# EasyEDA Pro project CANBUSdataLoggerProjectFileV1.2.epro

# Schematic Schematic1
Board Name: Board1; Create Date: 2025-11-18; Page Name: P1; Project Name: carInfoDisplay; Schematic Name: Schematic1; Update Date: 2025-11-19; Company: EasyEDA.com; Page Size: A4; Version: V1.0
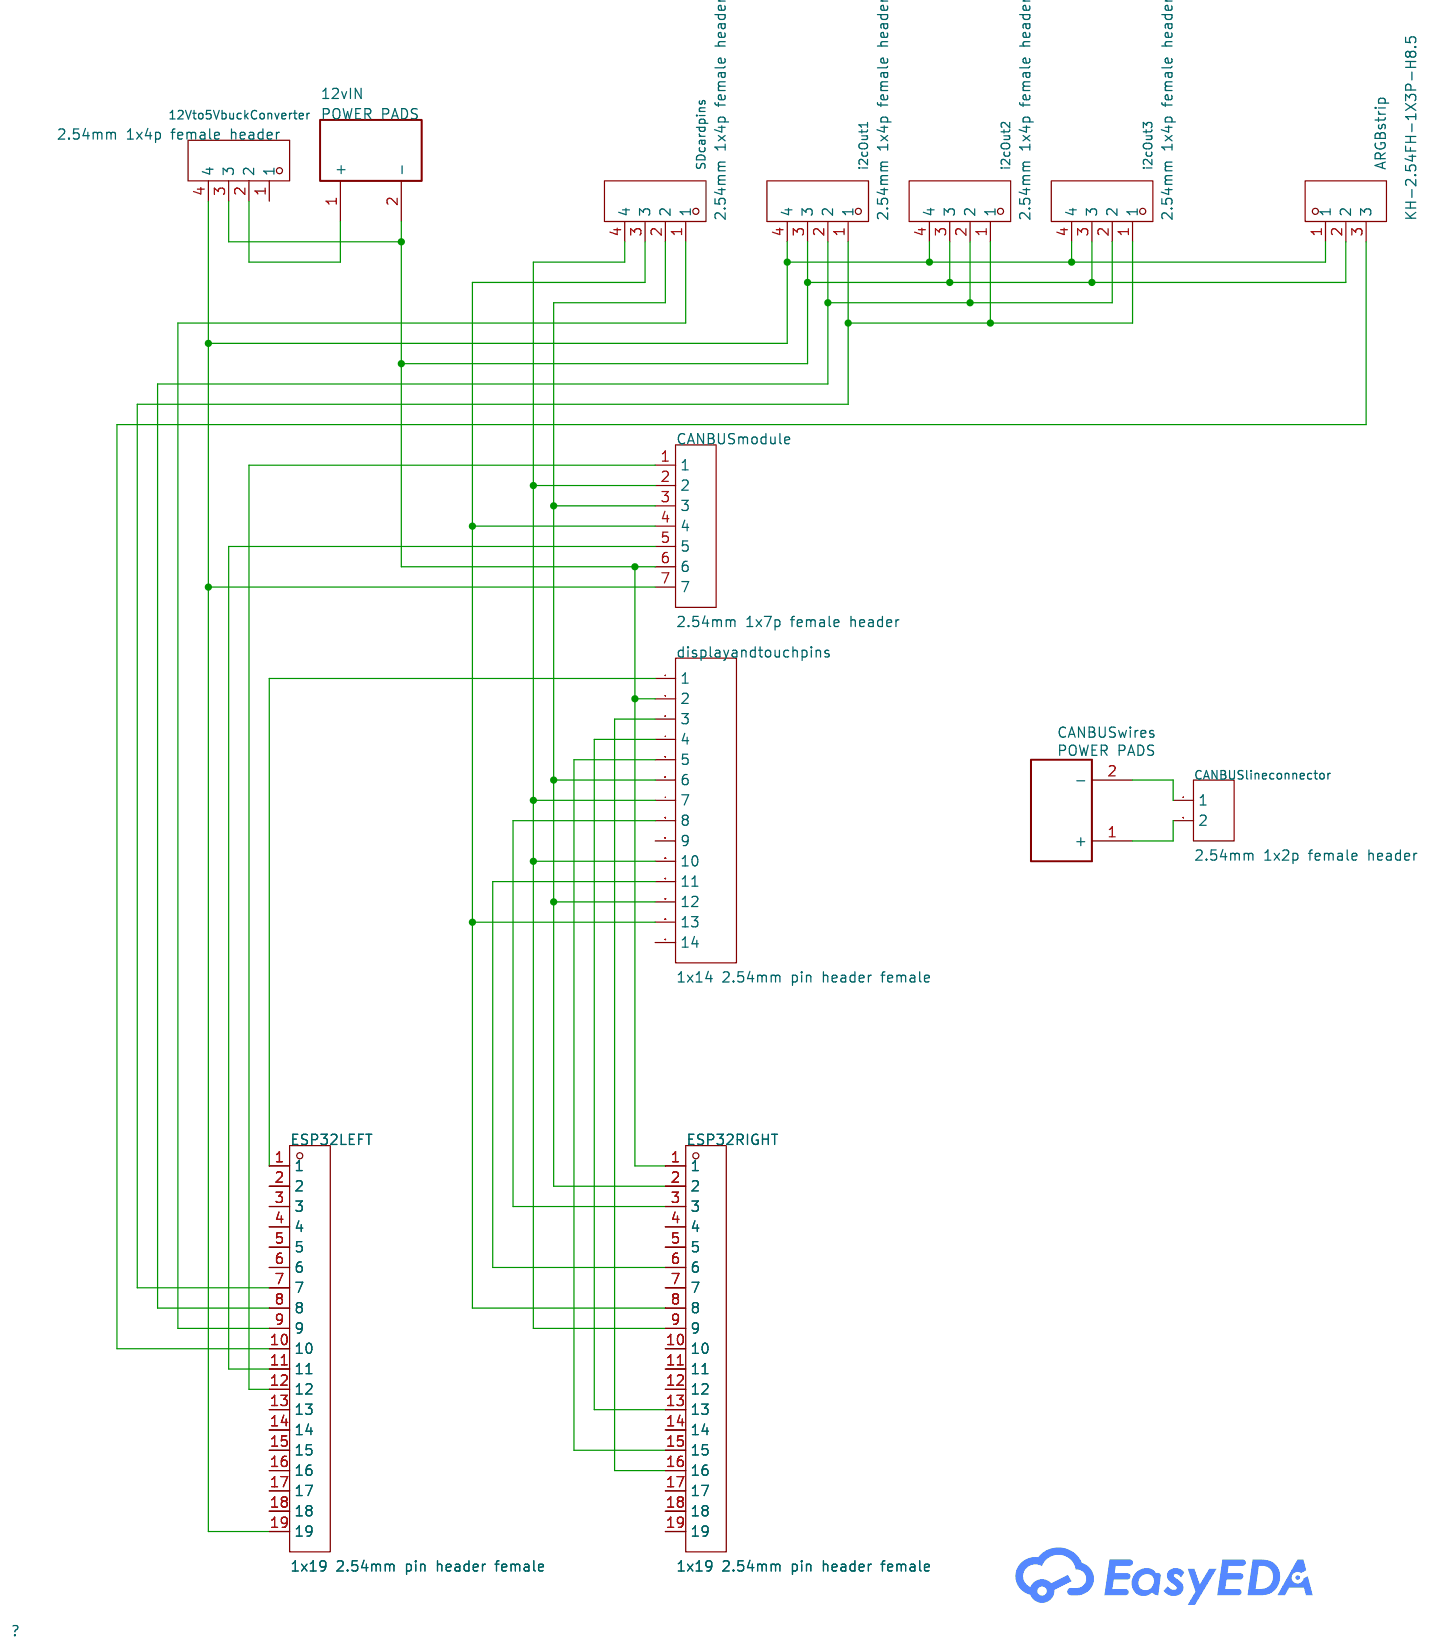
[diagram p0: schematic sheet]

## Parts
12vIN  POWER PADS  [POWERPADS]
12Vto5VbuckConverter  2.54mm 1x4p female header  [HDR-TH_4P-P2.54-V-F]
ARGBstrip  KH-2.54FH-1X3P-H8.5  [HDR-TH_3P-P2.54-V-F]
CANBUSlineconnector  2.54mm 1x2p female header  [HDR-TH_2P-P2.54-V-F]
CANBUSmodule  2.54mm 1x7p female header  [HDR-TH_7P-P2.54-V-F]
CANBUSwires  POWER PADS  [POWERPADS]
displayandtouchpins  1x14 2.54mm pin header female  [HDR-TH_14P-P2.54-V-F-1]
ESP32LEFT  1x19 2.54mm pin header female  [HDR-TH_19P-P2.54-V-F]
ESP32RIGHT  1x19 2.54mm pin header female  [HDR-TH_19P-P2.54-V-F]
i2cOut1  2.54mm 1x4p female header  [HDR-TH_4P-P2.54-V-F]
i2cOut2  2.54mm 1x4p female header  [HDR-TH_4P-P2.54-V-F]
i2cOut3  2.54mm 1x4p female header  [HDR-TH_4P-P2.54-V-F]
SDcardpins  2.54mm 1x4p female header  [HDR-TH_4P-P2.54-V-F]

## Library data of the parts
12vIN CANBUSwires = POWER PADS: Contributor: tomicode; spicePre: P
12Vto5VbuckConverter i2cOut1-i2cOut3 SDcardpins = 2.54-1*4P母: Holes Structure:1x4P Pitch:2.54mm Row Spacing:- Circular Hole / Square Hole:Square Hole Mounting Type:Through Hole Number of Rows:1 Number of Positions:4P Current Rating:3A Voltage Rating (Max):- Holes Direction:Top Insulation Height:- Contact Material:Br; LCSC Part Name: 间距:2.54mm 1x4P 直插; Supplier Part: C2718488; Manufacturer: BOOMELE(博穆精密); Supplier Footprint: 插件,P=2.54mm; JLCPCB Part Class: Extended Part; Datasheet: https://item.szlcsc.com/datasheet/2.54-1*4P%25E6%25AF%258D/2834502.html; Supplier: LCSC; Holes Structure: 1x4P; Pitch: 2.54mm; Circular Hole / Square Hole: Square Hole; Mounting Type: Through Hole; Number of Rows: 1; Number of Positions: 4P; Current Rating: 3A; Holes Direction: Top; Contact Material: Bronze; Operating Temperature: -40℃~+105℃
ARGBstrip = KH-2.54FH-1X3P-H8.5: Holes Structure:1x3P Pitch:2.54mm Row Spacing:- Circular Hole / Square Hole:Square Hole Mounting Type:Through Hole Number of Rows:1 Number of Positions:3P Current Rating:3A Voltage Rating (Max):- Holes Direction:Top Insulation Height:8.5mm Operating Tempe; LCSC Part Name: 间距:2.54mm 1x3P 直插; Supplier Part: C2932670; Manufacturer: kinghelm(金航标); Supplier Footprint: 插件,P=2.54mm; JLCPCB Part Class: Extended Part; Datasheet: https://item.szlcsc.com/datasheet/KH-2.54FH-1X3P-H8.5/3278191.html; Supplier: LCSC; Holes Structure: 1x3P; Pitch: 2.54mm; Circular Hole / Square Hole: Square Hole; Mounting Type: Through Hole; Number of Rows: 1; Number of Positions: 3P; Current Rating: 3A; Holes Direction: Top; Insulation Height: 8.5mm; Operating Temperature: -40℃~+105℃
CANBUSlineconnector = 2.54-1*2P母: Holes Structure:1x2P Pitch:2.54mm Row Spacing:- Circular Hole / Square Hole:Square Hole Mounting Type:Through Hole Number of Rows:1 Number of Positions:2P Current Rating:3A Holes Direction:Top Insulation Height:3.3mm Contact Material:- Contact Plating:- O; LCSC Part Name: 1x2P 间距:2.54mm 直插; Supplier Part: C49661; Manufacturer: BOOMELE(博穆精密); Supplier Footprint: 插件,P=2.54mm; JLCPCB Part Class: Extended Part; Datasheet: https://item.szlcsc.com/datasheet/2.54-1*2P%25E6%25AF%258D/50669.html; Supplier: LCSC; Holes Structure: 1x2P; Pitch: 2.54mm; Circular Hole / Square Hole: Square Hole; Mounting Type: Through Hole; Number of Rows: 1; Number of Positions: 2P; Current Rating: 3A; Holes Direction: Top; Insulation Height: 3.3mm; Operating Temperature: -40℃~+105℃
CANBUSmodule = HC-PM254-8.5H-1x7PZ: Holes Structure:1x7P Pitch:2.54mm Row Spacing:- Circular Hole / Square Hole:Square Hole Mounting Type:Through Hole Number of Rows:1 Number of Positions:7P Current Rating:3A Voltage Rating (Max):- Holes Direction:Top Insulation Height:8.5mm Contact Materia; LCSC Part Name: 间距2.54mm 1x7Pin 直插 PC3.0 H8.5; Supplier Part: C22373893; Manufacturer: HC(虹成电子); Supplier Footprint: 插件,P=2.54mm; JLCPCB Part Class: Extended Part; Datasheet: https://item.szlcsc.com/datasheet/HC-PM254-8.5H-1x7PZ/23870229.html; Supplier: LCSC; Holes Structure: 1x7P; Pitch: 2.54mm; Circular Hole / Square Hole: Square Hole; Mounting Type: Through Hole; Number of Rows: 1; Number of Positions: 7P; Current Rating: 3A; Holes Direction: Top; Insulation Height: 8.5mm; Contact Material: Brass; Contact Plating: Gold; Operating Temperature: -40℃~+105℃; PIN Length: 3mm
displayandtouchpins = 2.54-1*14P母: Holes Structure:1x14P Pitch:2.54mm Row Spacing:- Circular Hole / Square Hole:Square Hole Mounting Type:Through Hole Number of Rows:1 Number of Positions:14P Current Rating:3A Voltage Rating (Max):- Holes Direction:Top Insulation Height:3.3mm Contact Mater; LCSC Part Name: 1x14P 间距:2.54mm 直插; Supplier Part: C52711; Manufacturer: BOOMELE(博穆精密); Supplier Footprint: 插件,P=2.54mm; JLCPCB Part Class: Extended Part; Datasheet: https://item.szlcsc.com/datasheet/2.54-1*14P%25E6%25AF%258D/53725.html; Supplier: LCSC; Holes Structure: 1x14P; Pitch: 2.54mm; Circular Hole / Square Hole: Square Hole; Mounting Type: Through Hole; Number of Rows: 1; Number of Positions: 14P; Current Rating: 3A; Holes Direction: Top; Insulation Height: 3.3mm; Operating Temperature: -40℃~+105℃
ESP32LEFT ESP32RIGHT = KH-2.54FH-1X19P-H8.5: Holes Structure:1x19P Pitch:2.54mm Row Spacing:- Circular Hole / Square Hole:Square Hole Mounting Type:Through Hole Number of Rows:1 Number of Positions:19P Current Rating:3A Voltage Rating (Max):- Holes Direction:Top Insulation Height:8.5mm Operating Tem; LCSC Part Name: 间距:2.54mm 1x19P 直插; Supplier Part: C2932678; Manufacturer: kinghelm(金航标); Supplier Footprint: 插件,P=2.54mm; JLCPCB Part Class: Extended Part; Datasheet: https://item.szlcsc.com/datasheet/KH-2.54FH-1X19P-H8.5/3278199.html; Supplier: LCSC; Holes Structure: 1x19P; Pitch: 2.54mm; Circular Hole / Square Hole: Square Hole; Mounting Type: Through Hole; Number of Rows: 1; Number of Positions: 19P; Current Rating: 3A; Holes Direction: Top; Insulation Height: 8.5mm; Operating Temperature: -40℃~+105℃

## Nets
$1N1624: displayandtouchpins.1 ESP32LEFT.1
$1N1629: 12vIN.2(-) 12Vto5VbuckConverter.3 ARGBstrip.2 CANBUSmodule.6 displayandtouchpins.2 ESP32RIGHT.1 i2cOut1.3 i2cOut2.3 i2cOut3.3
$1N1636: displayandtouchpins.3 ESP32RIGHT.16
$1N1643: displayandtouchpins.4 ESP32RIGHT.13
$1N1650: displayandtouchpins.5 ESP32RIGHT.15
$1N1657: CANBUSmodule.3 displayandtouchpins.6 displayandtouchpins.12 ESP32RIGHT.2 SDcardpins.2
$1N1663: CANBUSmodule.2 displayandtouchpins.7 displayandtouchpins.10 ESP32RIGHT.9 SDcardpins.4
$1N1670: displayandtouchpins.8 ESP32RIGHT.3
$1N1691: displayandtouchpins.11 ESP32RIGHT.6
$1N1709: CANBUSmodule.4 displayandtouchpins.13 ESP32RIGHT.8 SDcardpins.3
$1N1824: CANBUSmodule.1 ESP32LEFT.12
$1N1870: CANBUSmodule.5 ESP32LEFT.11
$1N1888: 12Vto5VbuckConverter.4 ARGBstrip.1 CANBUSmodule.7 ESP32LEFT.19 i2cOut1.4 i2cOut2.4 i2cOut3.4
$1N1979: CANBUSlineconnector.2 CANBUSwires.1(+)
$1N1984: CANBUSlineconnector.1 CANBUSwires.2(-)
$1N2085: 12vIN.1(+) 12Vto5VbuckConverter.2
$1N2121: ESP32LEFT.9 SDcardpins.1
$1N2367: ESP32LEFT.8 i2cOut1.2 i2cOut2.2 i2cOut3.2
$1N2374: ESP32LEFT.7 i2cOut1.1 i2cOut2.1 i2cOut3.1
$1N3081: ARGBstrip.3 ESP32LEFT.10

Not connected (* = marked no-connect by the designer): 12Vto5VbuckConverter 1; displayandtouchpins 9 14; ESP32LEFT 2 3 4 5 6 13 14 15 16 17 18; ESP32RIGHT 4 5 7 10 11 12 14 17 18 19

# Board PCB1
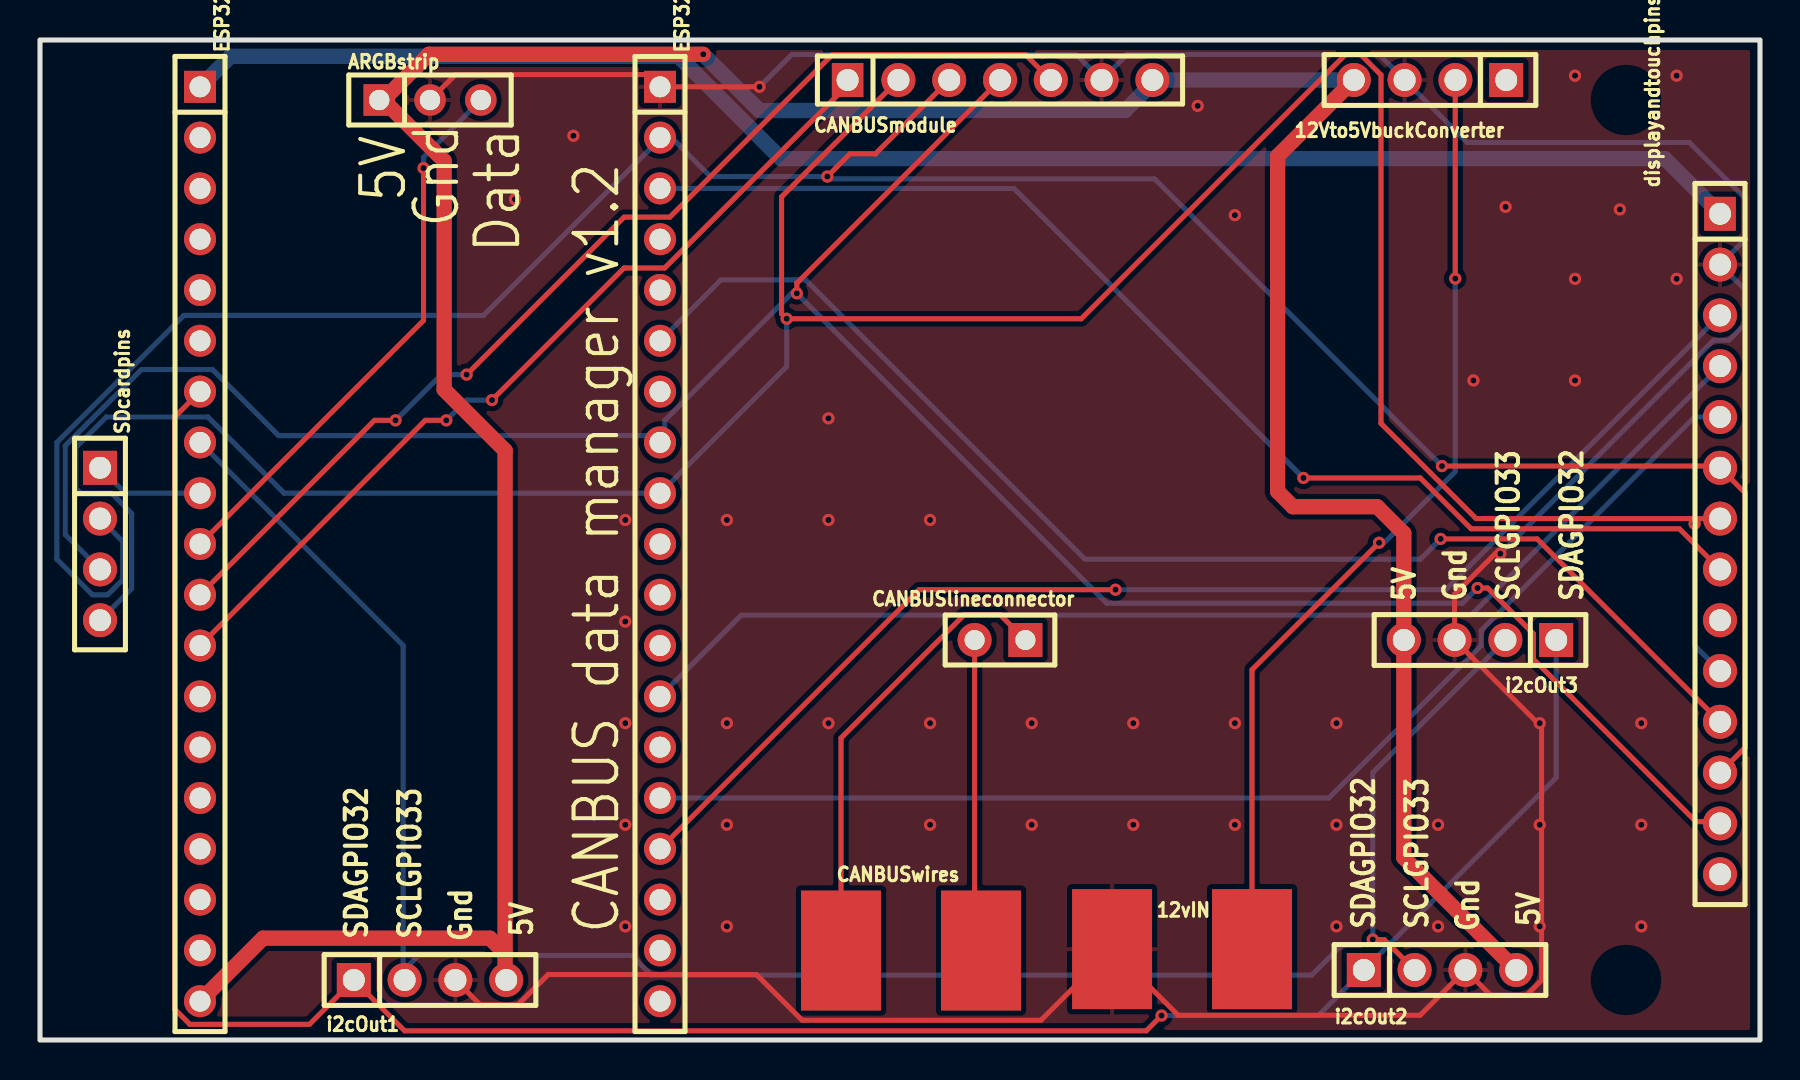
[diagram p1: board, top side]
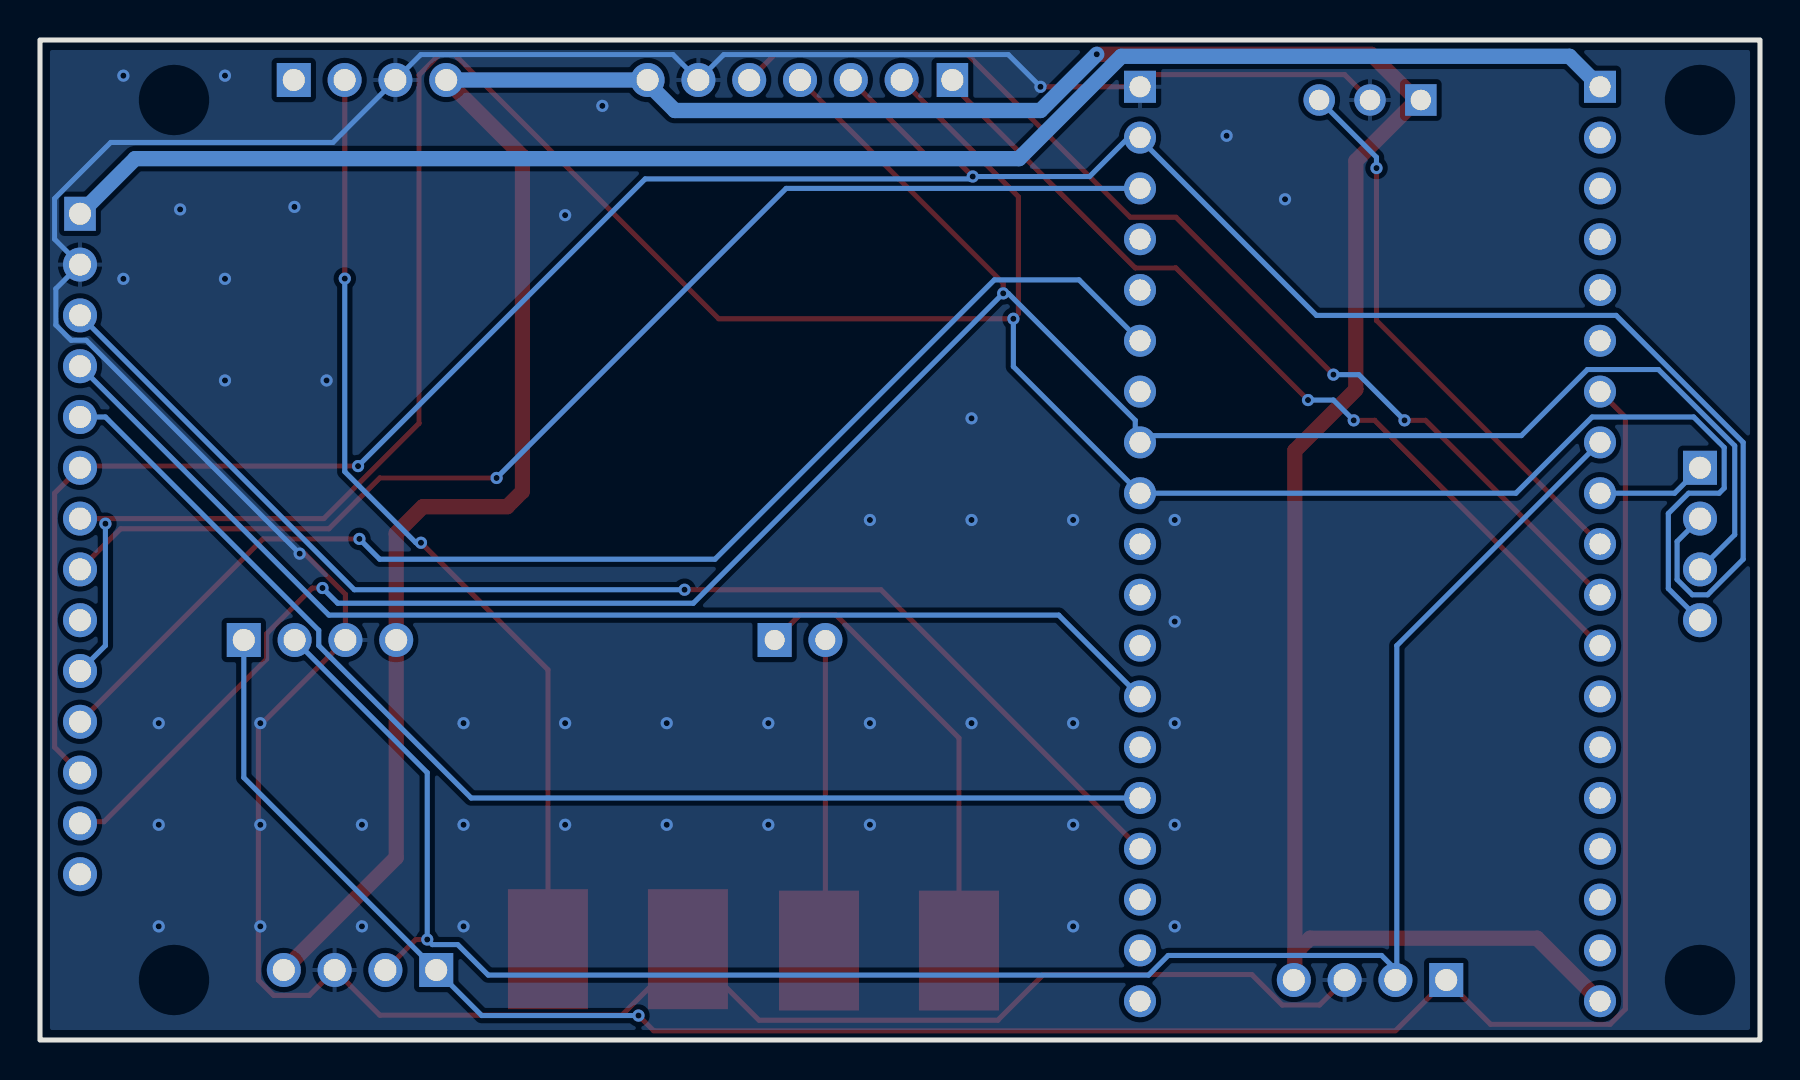
[diagram p2: board, bottom side, seen from below]

Outline 86 x 50 mm; copper layers: Top Layer, Bottom Layer. Coordinates in mm from the lower left corner of the outline.
Outline path: rectangle 0,50 86,0
Stack: Top Layer 0.035mm / Dielectric1 1.51mm FR4 er 4.5 / Bottom Layer 0.035mm

## Design rules (mm)
template: Custom Config
spacing copperThickness1oz (default): track to track 0.102, other pairs 0.152 to 0.3
spacing copperThickness2oz: track to track 0.203, other pairs 0.152 to 0.3
track width copperThickness1oz (default): min 0.127, default 0.254, max 2.54
track width copperThickness2oz: min 0.203, default 0.254, max 2.54
track width powerTracks: min 0.127, default 0.762, max 2.54
differential pair differentialPair (default): width min 0.127, default 0.254, max 2.54; gap min 0.152, default 0.152
via viaSize (default): diameter min 0.5, default 0.61, max 10; hole min 0.3, default 0.305, max 6.3
net $1N1888 uses powerTracks
net $1N1624 uses powerTracks

## Placement (name value [footprint] x y rotation side)
12vIN  POWER PADS  [POWERPADS]  60.54 4.39 90 top
12Vto5VbuckConverter  2.54mm 1x4p female header  [HDR-TH_4P-P2.54-V-F]  69.5 48 180 top
ARGBstrip  KH-2.54FH-1X3P-H8.5  [HDR-TH_3P-P2.54-V-F]  19.5 47 0 top
CANBUSlineconnector  2.54mm 1x2p female header  [HDR-TH_2P-P2.54-V-F]  48 20 180 top
CANBUSmodule  2.54mm 1x7p female header  [HDR-TH_7P-P2.54-V-F]  48 48 0 top
CANBUSwires  POWER PADS  [POWERPADS]  46.99 4.32 90 top
displayandtouchpins  1x14 2.54mm pin header female  [HDR-TH_14P-P2.54-V-F-1]  84 24.8 270 top
ESP32LEFT  1x19 2.54mm pin header female  [HDR-TH_19P-P2.54-V-F]  8 24.8 270 top
ESP32RIGHT  1x19 2.54mm pin header female  [HDR-TH_19P-P2.54-V-F]  31 24.8 270 top
i2cOut1  2.54mm 1x4p female header  [HDR-TH_4P-P2.54-V-F]  19.5 3 0 top
i2cOut2  2.54mm 1x4p female header  [HDR-TH_4P-P2.54-V-F]  70 3.5 0 top
i2cOut3  2.54mm 1x4p female header  [HDR-TH_4P-P2.54-V-F]  72 20 180 top
SDcardpins  2.54mm 1x4p female header  [HDR-TH_4P-P2.54-V-F]  3 24.8 270 top

## Footprints (pads in the part's own frame, mm; a bottom-side part is the same pattern mirrored in y, then rotated)
HDR-TH_2P-P2.54-V-F
  rect 1.7x1.7 hole 1: 1(-1.27,0)
  round 1.7 hole 1: 2(1.27,0)
HDR-TH_3P-P2.54-V-F
  rect 1.575x1.575 hole 1.02: 1(-2.54,0)
  round 1.575 hole 1.02: 2(0,0) 3(2.54,0)
HDR-TH_4P-P2.54-V-F
  rect 1.7x1.7 hole 1.1: 1(-3.81,0)
  round 1.7 hole 1.1: 2(-1.27,0) 3(1.27,0) 4(3.81,0)
HDR-TH_7P-P2.54-V-F
  rect 1.575x1.7 hole 1.1: 1(-7.62,0)
  round 1.7 hole 1.1: 2(-5.08,0) 3(-2.54,0) 4(0,0) 5(2.54,0) 6(5.08,0) 7(7.62,0)
HDR-TH_14P-P2.54-V-F-1
  rect 1.7x1.575 hole 1.1: 1(-16.51,0)
  round 1.7 hole 1.1: 2(-13.97,0) 3(-11.43,0) 4(-8.89,0) 5(-6.35,0) 6(-3.81,0) 7(-1.27,0) 8(1.27,0) 9(3.81,0) 10(6.35,0) 11(8.89,0) 12(11.43,0) 13(13.97,0) 14(16.51,0)
HDR-TH_19P-P2.54-V-F
  rect 1.6x1.6 hole 1.05: 1(-22.86,0)
  round 1.6 hole 1.05: 2(-20.32,0) 3(-17.78,0) 4(-15.24,0) 5(-12.7,0) 6(-10.16,0) 7(-7.62,0) 8(-5.08,0) 9(-2.54,0) 10(0,0) 11(2.54,0) 12(5.08,0) 13(7.62,0) 14(10.16,0) 15(12.7,0) 16(15.24,0) 17(17.78,0) 18(20.32,0) 19(22.86,0)
POWERPADS
  rect 6x4 smd: 1(0.152,-0.06) 2(0.152,6.939)

## Nets
As in the schematic.

Pads without a net: 12Vto5VbuckConverter 1; displayandtouchpins 9 14; ESP32LEFT 2 3 4 5 6 13 14 15 16 17 18; ESP32RIGHT 4 5 7 10 11 12 14 17 18 19

## Via types
v1: diameter 0.61, hole 0.305, Top Layer to Bottom Layer, 65 vias

## Routing (per net, layer and track width the routed paths; a pad name or vN(x,y) marks a point on that pad's centre or on a via; arc(x,y) is an arc through that point)
$1N1624: length 79.9
  Bottom Layer w0.762: displayandtouchpins.1 81.24,44.07 37.04,44.07 31.93,49.18 9.52,49.18 ESP32LEFT.1
$1N1629: length 180.8
  Top Layer w0.254: v1(73.02,24.32) 72.76,24.32 70.73,22.29 i2cOut3.3 75.08,15.65 75.08,2.99 74.32,2.23 72.54,2.23 i2cOut2.3 69.01,1.24 56.9,1.24 53.6,4.54 50.05,0.99 38.11,0.99 35.82,3.27 25.41,3.27 23.88,1.75 22.02,1.75 i2cOut1.3 ; v1(35.98,47.66) ESP32RIGHT.1 30.39,48.27 20.77,48.27 ARGBstrip.2
  Bottom Layer w0.254: v1(73.02,24.32) 83.68,34.99 84.45,34.99 85.21,35.75 85.21,37.56 displayandtouchpins.2 85.27,40.04 85.27,42.07 82.47,44.88 71.35,44.88 12Vto5VbuckConverter.3 66.96,49.27 54.35,49.27 CANBUSmodule.6 51.81,49.27 37.59,49.27 v1(35.98,47.66)
  vias: v1(23.75,42.04) v1(26.67,45.21) v1(29.26,26) v1(29.26,20.92) v1(29.26,15.84) v1(29.26,10.76) v1(29.26,5.68) v1(34.34,26) v1(34.34,15.84) v1(34.34,10.76) v1(34.34,5.68) v1(39.42,31.08) v1(39.42,26) v1(39.42,15.84) v1(44.5,26) v1(44.5,15.84) v1(44.5,10.76) v1(49.58,15.84) v1(49.58,10.76) v1(54.66,15.84) v1(54.66,10.76) v1(57.88,46.71) v1(59.74,41.24) v1(59.74,15.84) v1(59.74,10.76) v1(64.82,15.84) v1(64.82,10.76) v1(64.82,5.68) v1(69.9,10.76) v1(69.9,5.68) v1(71.67,32.98) v1(73.28,41.66) v1(74.98,15.84) v1(74.98,10.76) v1(74.98,5.68) v1(76.75,48.22) v1(76.75,38.06) v1(76.75,32.98) v1(78.99,41.53) v1(80.06,15.84) v1(80.06,10.76) v1(80.06,5.68) v1(81.83,48.22) v1(81.83,38.06)
$1N1636: length 64
  Top Layer w0.254: ESP32RIGHT.16 43.95,22.51 v1(53.77,22.51)
  Bottom Layer w0.254: v1(53.77,22.51) 70.28,22.51 displayandtouchpins.3
$1N1643: length 59.8
  Bottom Layer w0.254: displayandtouchpins.4 71.55,21.24 35.06,21.24 ESP32RIGHT.13
$1N1650: length 61.3
  Bottom Layer w0.254: displayandtouchpins.5 82.73,31.15 72.06,20.48 72.06,19.72 64.44,12.1 ESP32RIGHT.15
$1N1657: length 134.5
  Top Layer w0.254: v1(70.1,28.7) 83.91,28.7 displayandtouchpins.6 85.27,27.34 85.27,14.64 displayandtouchpins.12 ; CANBUSmodule.3 41.77,44.31 40.5,44.31 v1(39.36,43.17)
  Bottom Layer w0.254: 31.07,45.12 ESP32RIGHT.2 ; 31.07,45.12 22.18,36.23 7.19,36.23 0.84,29.88 0.84,24.04 2.62,22.26 3.38,22.26 4.14,23.02 4.14,24.93 SDcardpins.2 ; 31.07,45.12 31.58,45.12 33.52,43.17 v1(39.36,43.17) 39.49,43.05 55.74,43.05 v1(70.1,28.7)
$1N1663: length 148.7
  Top Layer w0.254: CANBUSmodule.2 37.08,42.16 37.08,36.32 v1(37.33,36.06) 52.06,36.06 65.27,49.27 66.03,49.27 67.05,48.25 67.05,30.83 71.81,26.07 82.73,26.07 ; 82.73,26.07 displayandtouchpins.7 ; 82.73,26.07 v1(82.73,25.82)
  Bottom Layer w0.254: v1(37.33,36.06) 37.33,33.67 ESP32RIGHT.9 12.2,27.34 8.39,31.15 3.31,31.15 1.79,29.63 1.79,27.59 2.04,27.34 3.57,27.34 4.58,26.32 4.58,22.57 SDcardpins.4 ; v1(82.73,25.82) 82.73,19.72 displayandtouchpins.10
$1N1670: length 60.9
  Top Layer w0.254: v1(63.17,28.1) 69.01,28.1 71.55,25.56 81.97,25.56 displayandtouchpins.8
  Bottom Layer w0.254: v1(63.17,28.1) 48.69,42.58 ESP32RIGHT.3
$1N1691: length 64.3
  Top Layer w0.254: displayandtouchpins.11 74.86,25.05 v1(70.03,25.05)
  Bottom Layer w0.254: v1(70.03,25.05) 69.01,24.04 52.25,24.04 38.28,38.01 34.05,38.01 ESP32RIGHT.6
$1N1709: length 123.6
  Top Layer w0.254: v1(37.84,37.33) 37.84,37.84 CANBUSmodule.4 ; v1(71.88,22.6) 72.38,22.6 74.67,20.31 74.67,19.04 82.8,10.92 83.91,10.92 displayandtouchpins.13
  Bottom Layer w0.254: SDcardpins.3 1.26,25.27 1.26,29.71 5.07,33.52 8.63,33.52 11.93,30.22 31.24,30.22 ; 31.24,30.22 31.24,30.98 37.59,37.33 v1(37.84,37.33) 53.33,21.84 71.11,21.84 v1(71.88,22.6) ; 31.24,30.22 31.24,30.12 ESP32RIGHT.8
$1N1824: length 44.2
  Top Layer w0.254: ESP32LEFT.12 19.26,30.98 v1(20.31,30.98) ; CANBUSmodule.1 40.38,47.75 31.24,38.6 29.2,38.6 v1(22.6,32)
  Bottom Layer w0.254: v1(22.6,32) 21.33,32 v1(20.31,30.98)
$1N1870: length 54.3
  Top Layer w0.254: ESP32LEFT.11 16.72,30.98 v1(17.77,30.98) ; CANBUSmodule.5 49.27,49.27 39.62,49.27 31.49,41.14 29.2,41.14 v1(21.33,33.27)
  Bottom Layer w0.254: v1(17.77,30.98) 20.06,33.27 v1(21.33,33.27)
$1N1888: length 168.6
  Top Layer w0.762: ESP32LEFT.19 11.15,5.09 22.49,5.09 23.26,4.33 ; i2cOut1.4 23.26,3.05 23.26,4.33 ; 23.26,4.33 23.26,29.47 20.21,32.52 20.21,43.95 17.16,47 ; i2cOut2.4 68.19,9.12 i2cOut3.4 68.19,25.33 66.86,26.66 62.64,26.66 61.88,27.43 61.88,44.19 12Vto5VbuckConverter.4 ; v1(33.16,49.29) 19.45,49.29 17.16,47 ; 17.16,47 ARGBstrip.1
  Bottom Layer w0.762: v1(33.16,49.29) 35.97,46.48 54.26,46.48 55.78,48 ; 12Vto5VbuckConverter.4 55.78,48 ; 55.78,48 CANBUSmodule.7
$1N1979: length 15.7
  Top Layer w0.254: CANBUSwires.1 46.73,4.79 CANBUSlineconnector.2
$1N1984: length 22.9
  Top Layer w0.254: CANBUSwires.2 40.05,15.1 46.22,21.27 48,21.27 CANBUSlineconnector.1
$1N2085: length 47.8
  Top Layer w0.254: v1(66.95,24.86) 60.6,18.51 60.6,4.54 ; 12Vto5VbuckConverter.2 70.76,47.99 v1(70.76,38.07)
  Bottom Layer w0.254: v1(66.95,24.86) 67.21,24.86 70.76,28.42 v1(70.76,38.07)
$1N2121: length 5.5
  Bottom Layer w0.254: ESP32LEFT.9 4.27,27.34 SDcardpins.1
$1N2367: length 101.5
  Top Layer w0.254: i2cOut2.2 67.21,5.02 v1(66.64,5.02)
  Bottom Layer w0.254: i2cOut1.2 18.16,3.07 18.16,3.46 ; 18.16,3.46 18.92,4.23 29.59,4.23 30.57,3.25 63.59,3.25 65.11,4.77 66.38,4.77 v1(66.64,5.02) 66.64,13.37 i2cOut3.2 ; 18.16,3.46 18.16,19.72 ESP32LEFT.8
$1N2374: length 114.9
  Top Layer w0.254: v1(56.08,1.22) 55.31,0.46 18.23,0.46 i2cOut1.1 13.47,0.78 7.49,0.78 6.73,1.55 6.73,31.15 ESP32LEFT.7
  Bottom Layer w0.254: i2cOut3.1 75.81,13.12 i2cOut2.1 63.91,1.22 v1(56.08,1.22)
$1N3081: length 28
  Top Layer w0.254: ESP32LEFT.10 19.18,35.98 v1(19.18,43.6)
  Bottom Layer w0.254: ARGBstrip.3 19.18,44.14 v1(19.18,43.6)

## Copper pours and planes (outline as drawn; the poured copper is in the pictures)
$1N1629 on Top Layer: 0.5,49.5 85.5,49.5 85.5,0.5 0.5,0.5
$1N1629 on Bottom Layer: 0.5,49.5 85.5,49.5 85.5,0.5 0.5,0.5

## Text on the board
Top Silkscreen Layer: 5V | Gnd | SCLGPIO33 | SDAGPIO32 | Data | CANBUS data manager v1.2
